# EAGLE design 4313 Breakout V1.0 (EAGLE 6.5.0)
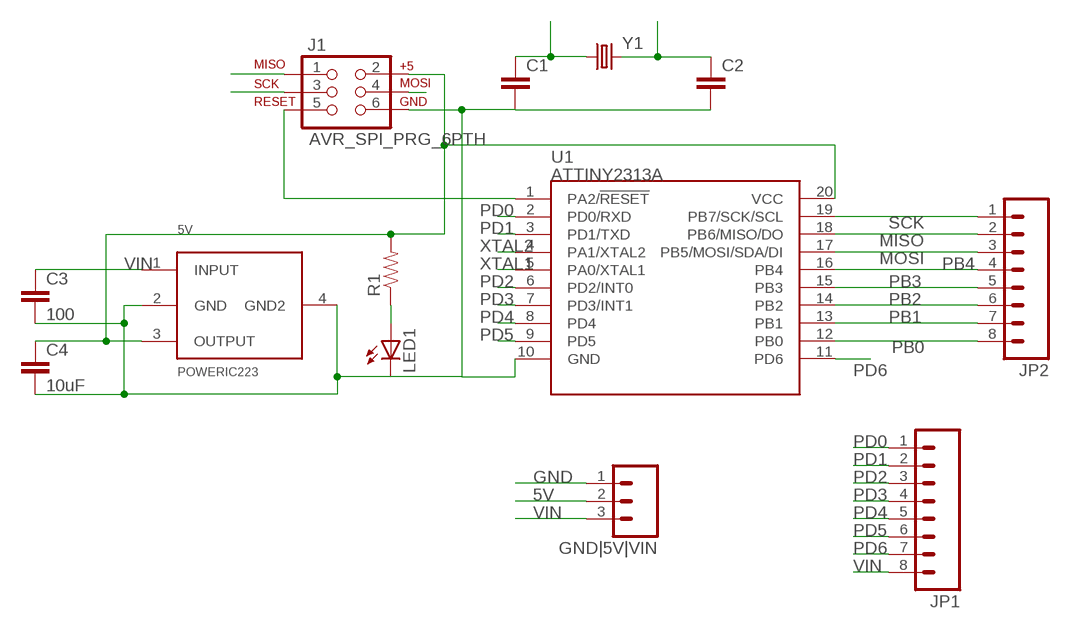
[diagram p0: schematic, sheet 1]

## Parts
5V  POWERIC223  [SOT223]
C1  CAP1206  [1206]
C2  CAP1206  [1206]
C3  100  CAP1210  [1210]
C4  10uF  CAP1210  [1210]
GND|5V|VIN  M03PTH  [1X03]
J1  AVR_SPI_PRG_6PTH  [2X3]
JP1  M081X08  [1X08]
JP2  M081X08  [1X08]
LED1  LED1206  [LED-1206]
R1  RESISTOR1206  [1206]
U1  ATTINY2313A  [SOP20W]
Y1  CRYSTALHC49US  [HC49US]

## Nets
5V: 5V.3(OUTPUT) C4.1 GND|5V|VIN.2 J1.2 R1.2 U1.20(VCC)
GND: 5V.2(GND) 5V.4(GND2) C1.2 C2.2 C3.2 C4.2 GND|5V|VIN.1 J1.6 LED1.C U1.10(GND)
MISO: J1.1 JP2.2 U1.18(PB6/MISO/DO)
MOSI: J1.4 JP2.3 U1.17(PB5/MOSI/SDA/DI)
N$1: LED1.A R1.1
N$21: J1.5 U1.1(PA2/!RESET)
PB0: JP2.8 U1.12(PB0)
PB1: JP2.7 U1.13(PB1)
PB2: JP2.6 U1.14(PB2)
PB3: JP2.5 U1.15(PB3)
PB4: JP2.4 U1.16(PB4)
PD0: JP1.1 U1.2(PD0/RXD)
PD1: JP1.2 U1.3(PD1/TXD)
PD2: JP1.3 U1.6(PD2/INT0)
PD3: JP1.4 U1.7(PD3/INT1)
PD4: JP1.5 U1.8(PD4)
PD5: JP1.6 U1.9(PD5)
PD6: JP1.7 U1.11(PD6)
SCK: J1.3 JP2.1 U1.19(PB7/SCK/SCL)
VIN: 5V.1(INPUT) C3.1 GND|5V|VIN.3 JP1.8
XTAL1: C1.1 U1.5(PA0/XTAL1) Y1.1
XTAL2: C2.1 U1.4(PA1/XTAL2) Y1.2

## Library data of the parts
5V = NU STEM:POWERIC223
C1 C2 = SparkFun-Passives:CAP: Capacitor Standard 0603 ceramic capacitor, and 0.1" leaded capacitor.
C3 C4 = SparkFun-Capacitors:CAP: Capacitor Standard 0603 ceramic capacitor, and 0.1" leaded capacitor.
GND|5V|VIN = SparkFun-Connectors:M03: Header 3 Standard 3-pin 0.1" header. Use with straight break away headers (SKU : PRT-00116), right angle break away headers (PRT-00553), swiss pins (PRT-00743), machine pins (PRT-00117), and female headers (PRT-00115). Molex polarized connector foot print use with SKU : PRT-08232 with associated crimp pins and housings.
J1 = SparkFun-Connectors:AVR_SPI_PRG_6: AVR ISP 6 Pin This is the reduced ISP connector for AVR programming. Common on Arduino. This footprint will take up less PCB space and can be used with a 10-pin to 6-pin adapter such as SKU: BOB-08508
JP1 JP2 = SparkFun-Connectors:M08: Header 8 Standard 8-pin 0.1" header. Use with straight break away headers (SKU : PRT-00116), right angle break away headers (PRT-00553), swiss pins (PRT-00743), machine pins (PRT-00117), and female headers (PRT-00115).
LED1 = SparkFun-LED:LED: LEDs Standard schematic elements and footprints for 5mm, 3mm, 1206, and 0603 sized LEDs. 5mm - Spark Fun Electronics SKU : COM-00529 (and others)
R1 = SparkFun-Resistors:RESISTOR: Resistor Basic schematic elements and footprints for 0603, 1206, and PTH resistors.
U1 = SparkFun-DigitalIC:ATTINY2313A: ATTINY2313A 2kB 20MHz I2C/SPI/UART; PROD_ID: IC-11305
Y1 = SparkFun-FreqCtrl:CRYSTAL: Various standard crystals. Proven footprints. Spark Fun Electronics SKU : COM-00534

## Board
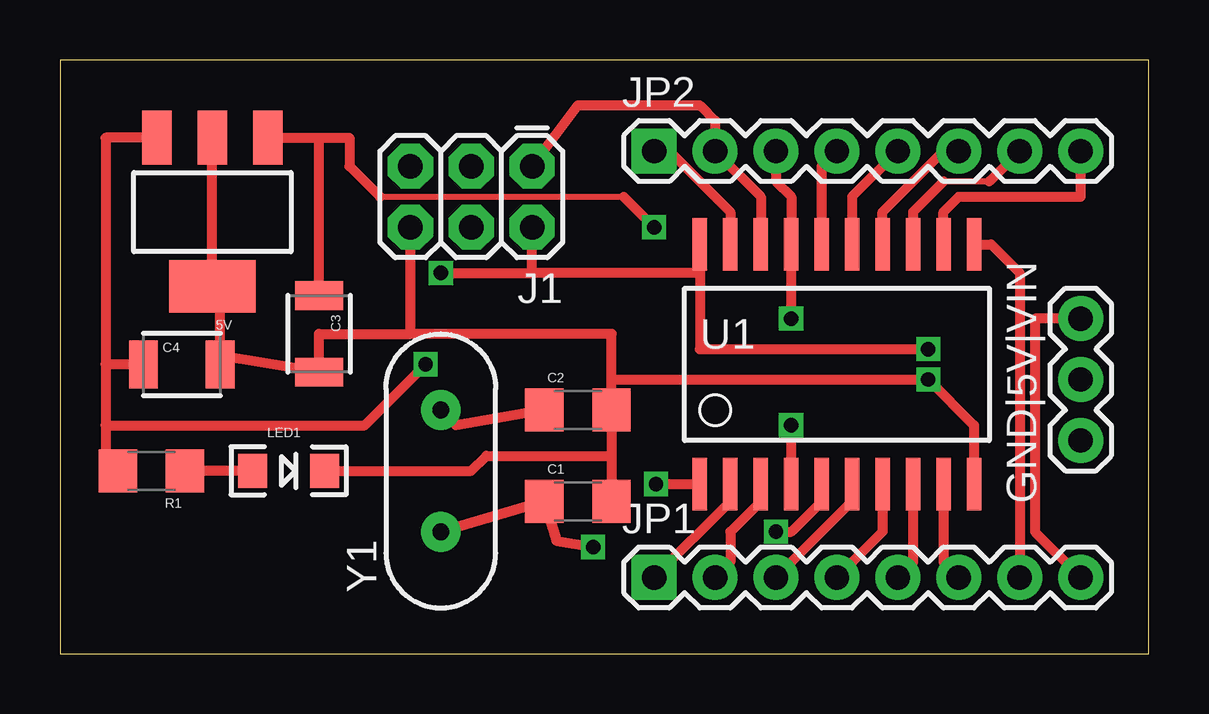
[diagram p1: board, top side]
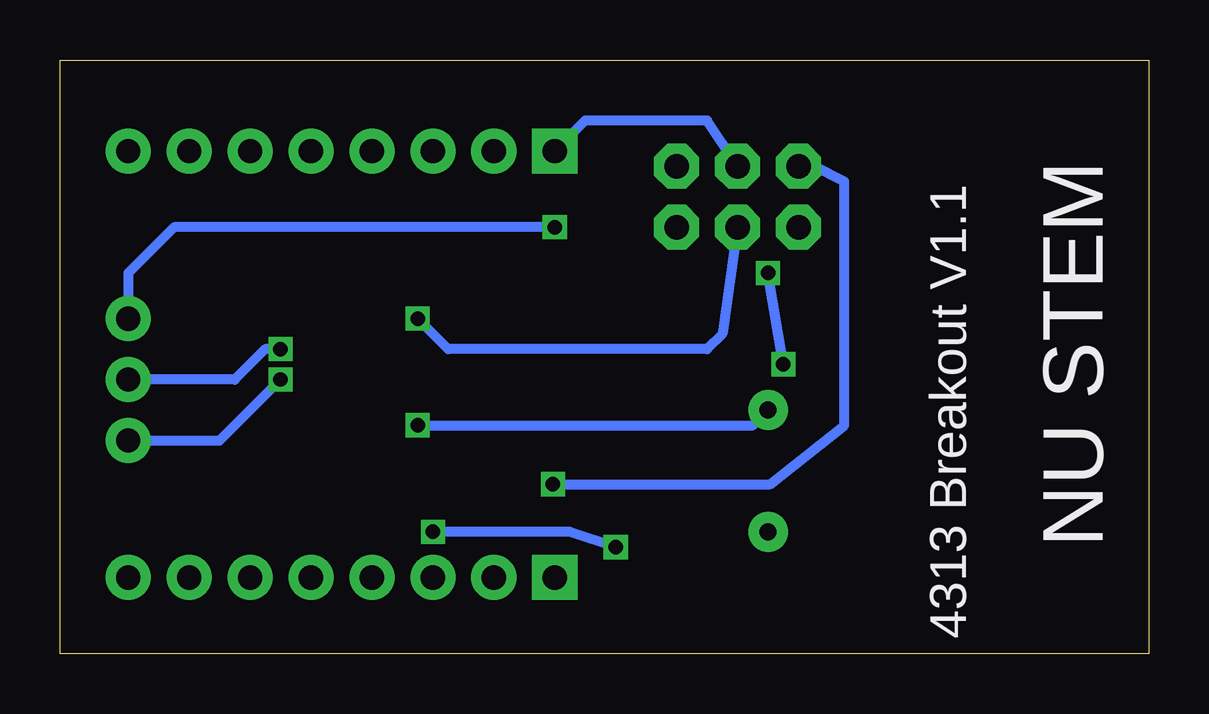
[diagram p2: board, bottom side, seen from below]

Size 45.39 x 24.75 mm. Coordinates in mm from the lower left corner, seen from the top.
Outline: 0,0 45.39,0 45.39,24.75 0,24.75 0,0
Copper layers (1*16): Top 0.035mm / dielectric 1.5mm / Bottom 0.035mm
Design rules "default": minimum track width 10mil, minimum drill 24mil, track to track 8mil, track to pad 8mil, pad to pad 8mil, via to via 8mil, smd to smd 8mil, copper to edge 40mil, drill to drill 8mil, minimum pad ring 10mil, minimum via ring 8mil, stop-mask expansion 4mil, vias tented up to drill 0mil, thermal gap 10mil

### Footprints (pad centres in the part's own frame; a part is rotated, then mirrored left to right if it is on the bottom)
SOT223 = smd 1.219 x 2.235: 1 -2.311,-3.099; 2 0,-3.099; 3 2.311,-3.099 | smd 3.6 x 2.2: 4 0,3.099
1206 = smd 1.6 x 1.8: 1 -1.4,0; 2 1.4,0
1210 = smd 1.2 x 2: 1 -1.6,0; 2 1.6,0
1X03 = drill 1.016 pad 1.88: 1 0,0; 2 2.54,0; 3 5.08,0
2X3 = drill 1.016 pad 1.88 octagon: 1 0,0; 2 0,2.54; 3 2.54,0; 4 2.54,2.54; 5 5.08,0; 6 5.08,2.54
1X08 = drill 1.016 pad 1.88 square: 1 0,0 | drill 1.016 pad 1.88: 2 2.54,0; 3 5.08,0; 4 7.62,0; 5 10.16,0; 6 12.7,0; 7 15.24,0; 8 17.78,0
LED-1206 = smd 1.2 x 1.4: A -1.5,0; C 1.5,0
SOP20W = smd 0.6 x 2.2: 1 -5.715,-5; 2 -4.445,-5; 3 -3.175,-5; 4 -1.905,-5; 5 -0.635,-5; 6 0.635,-5; 7 1.905,-5; 8 3.175,-5; 9 4.445,-5; 10 5.715,-5; 11 5.715,5; 12 4.445,5; 13 3.175,5; 14 1.905,5; 15 0.635,5; 16 -0.635,5; 17 -1.905,5; 18 -3.175,5; 19 -4.445,5; 20 -5.715,5
HC49US = drill 0.7 pad 1.651: 1 -2.54,0; 2 2.54,0

### Placement (x,y rotation side)
5V  6.35,18.41 180 top
C1  21.59,6.35 0 top
C2  21.59,10.16 0 top
C3  10.79,13.34 270 top
C4  5.08,12.06 0 top
GND|5V|VIN  42.55,8.89 90 top
J1  19.68,20.32 180 top
JP1  24.77,3.17 0 top
JP2  24.77,20.95 0 top
LED1  9.53,7.62 0 top
R1  3.81,7.62 180 top
U1  32.38,12.06 0 top
Y1  15.88,7.62 90 top

### Tracks (layer width: path | path; a pad name or v marks a point on that pad's centre or on a via)
5V  (via drill 0.6)
  Top 0.406: 19.68,15.88 J1.2 | 26.67,15.88 26.67,12.7 v36.2,12.7 | 1.91,9.53 12.7,9.53 v15.24,12.06 | v15.88,15.88 19.68,15.88 | 5V.3 1.91,21.51 1.91,12.06 | 1.91,12.06 1.91,9.53 | C4.1 1.91,12.06 | 1.91,9.53 1.91,8.12 R1.2 | U1.20 26.67,15.88 | 26.67,15.88 19.68,15.88
  Bottom 0.406: v36.2,12.7 36.83,12.7 38.1,11.43 GND|5V|VIN.2 | v15.24,12.06 v15.88,15.88
GND  (via drill 0.6)
  Top 0.406: C2.2 22.99,8.26 | 22.99,8.26 C1.2 | U1.10 38.1,9.53 v36.2,11.43 22.99,11.43 C2.2 | 5V.2 5V.4 6.68,14.99 C4.2 6.98,12.37 C3.2 10.79,13.34 14.61,13.34 | LED1.C 17.14,7.62 17.78,8.26 22.99,8.26 | 14.61,13.34 J1.6 | C2.2 22.99,13.34 14.61,13.34
  Bottom 0.406: GND|5V|VIN.1 38.74,8.89 v36.2,11.43
MISO
  Top 0.406: U1.18 29.21,19.05 JP2.2 27.3,22.23 26.67,22.86 21.59,22.86 J1.1
MOSI  (via drill 0.6)
  Top 0.406: JP2.3 29.84,19.68 30.48,19.05 U1.17 v30.48,13.97
  Bottom 0.406: J1.4 17.78,13.34 18.41,12.7 29.21,12.7 v30.48,13.97
N$1
  Top 0.406: LED1.A R1.1
N$21  (via drill 0.6)
  Top 0.406: U1.1 v24.84,7.07
  Bottom 0.406: v24.84,7.07 15.79,7.07 12.7,9.53 12.7,19.68 13.97,20.32 J1.5
PB0
  Top 0.406: U1.12 36.83,18.41 37.47,19.05 42.55,19.05 JP2.8
PB1
  Top 0.254: 38.74,19.68 36.83,19.68
  Top 0.406: JP2.7 38.74,19.68 | 36.83,19.68 35.56,18.41 U1.13
PB2
  Top 0.406: U1.14 34.29,18.41 36.83,20.95 JP2.6
PB3
  Top 0.406: JP2.5 33.02,19.05 U1.15
PB4
  Top 0.406: U1.16 31.75,20.32 JP2.4
PD0
  Top 0.406: U1.2 27.94,6.35 JP1.1
PD1
  Top 0.406: U1.3 29.21,6.35 27.94,5.08 27.94,3.81 JP1.2
PD2
  Top 0.406: U1.6 33.02,6.35 JP1.3
PD3
  Top 0.406: U1.7 34.29,5.08 JP1.4
PD4
  Top 0.406: U1.8 35.56,3.81 JP1.5
PD5
  Top 0.406: U1.9 36.83,3.81 JP1.6
PD6
  Top 0.406: U1.11 38.82,17.07 40.01,15.88 JP1.7
SCK
  Top 0.406: JP2.1 25.4,20.95 27.94,18.41 U1.19
  Bottom 0.406: J1.3 18.41,22.23 23.5,22.23 JP2.1
VIN  (via drill 0.6)
  Top 0.254: 13.33,19.05 23.5,19.05
  Top 0.406: GND|5V|VIN.3 40.64,13.97 40.64,5.08 JP1.8 | 13.33,19.05 12.06,20.32 12.06,21.51 10.79,21.51 | 23.5,19.05 v24.77,17.78 | 5V.1 10.79,21.51 | C3.1 10.79,21.51
  Bottom 0.406: v24.77,17.78 40.64,17.78 42.55,15.88 GND|5V|VIN.3
XTAL1  (via drill 0.6)
  Top 0.406: Y1.1 C1.1 20.69,4.71 v22.22,4.45 | v29.84,5.08 30.48,5.08 31.75,6.35 U1.5
  Bottom 0.406: v22.22,4.45 24.13,5.08 v29.84,5.08
XTAL2  (via drill 0.6)
  Top 0.406: C2.1 16.51,9.53 Y1.2 | U1.4 v30.48,9.53
  Bottom 0.406: v30.48,9.53 16.51,9.53 Y1.2

### Text on the board
_bsilk: NU STEM | 4313 Breakout V1.1